# Altium schematic sheet HIGHSPEED_v0_POWER-SUPPLIES.SchDoc
size A
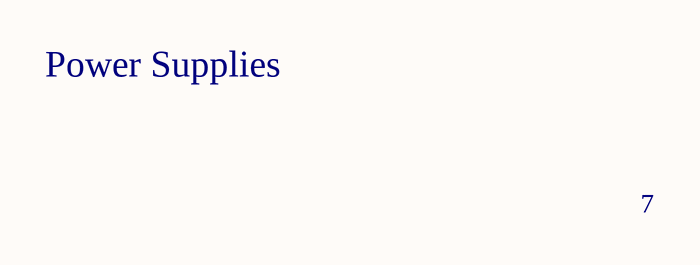
[diagram p0: HIGHSPEED_v0_POWER-SUPPLIES.SchDoc]

## Notes on the sheet
- Power Supplies
- 7